# EAGLE design ATmega32u4_Example (EAGLE 9.3.2)
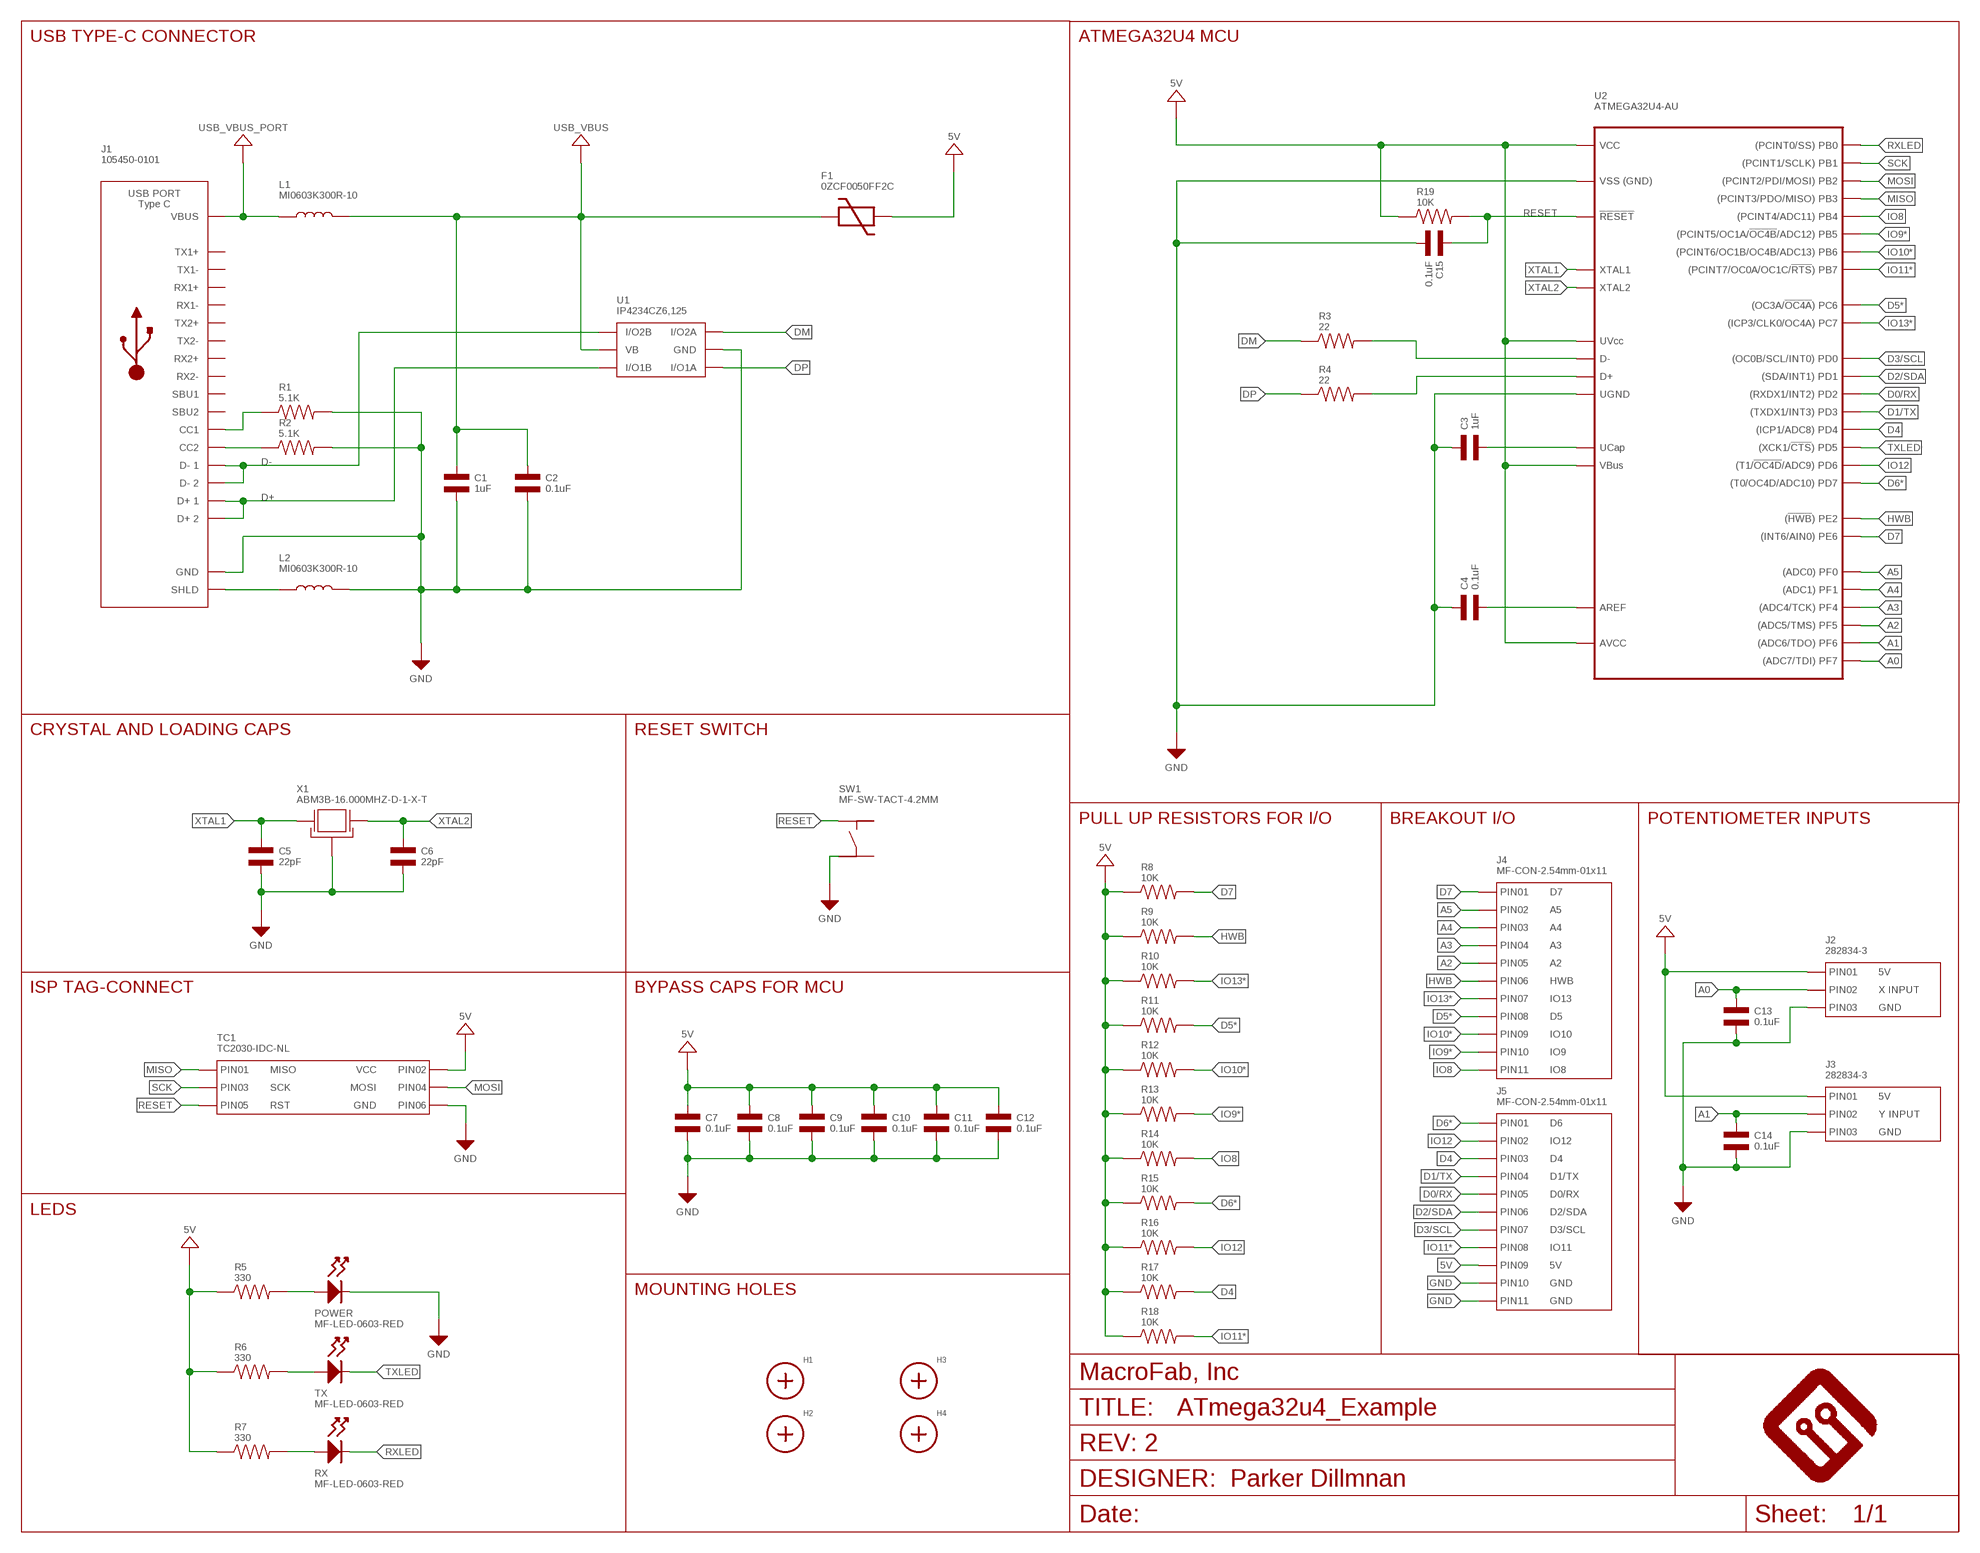
[diagram p0: schematic, sheet 1]

## Parts
C1  1uF  CAPACITOR_NP_0603  [C0603]
C2  0.1uF  CAPACITOR_NP_0603  [C0603]
C3  1uF  CAPACITOR_NP_0603  [C0603]
C4  0.1uF  CAPACITOR_NP_0603  [C0603]
C5  22pF  CAPACITOR_NP_0603  [C0603]
C6  22pF  CAPACITOR_NP_0603  [C0603]
C7  0.1uF  CAPACITOR_NP_0603  [C0603]
C8  0.1uF  CAPACITOR_NP_0603  [C0603]
C9  0.1uF  CAPACITOR_NP_0603  [C0603]
C10  0.1uF  CAPACITOR_NP_0603  [C0603]
C11  0.1uF  CAPACITOR_NP_0603  [C0603]
C12  0.1uF  CAPACITOR_NP_0603  [C0603]
C13  0.1uF  CAPACITOR_NP_0603  [C0603]
C14  0.1uF  CAPACITOR_NP_0603  [C0603]
C15  0.1uF  CAPACITOR_NP_0603  [C0603]
F1  0ZCF0050FF2C  PTC_FUSE_2920  [2920]
FRAME1  MF_FRAMEDEFAULT  [MF_FRAME_DEFAULT]
H1  MOUNT_HOLE150MIL  [MOUNT_HOLE_150MIL]
H2  MOUNT_HOLE150MIL  [MOUNT_HOLE_150MIL]
H3  MOUNT_HOLE150MIL  [MOUNT_HOLE_150MIL]
H4  MOUNT_HOLE150MIL  [MOUNT_HOLE_150MIL]
J1  105450-0101  USB_TYPE-C_105450-0101  [105450-0101]
J2  282834-3  CON_01X03_282834-3  [282834-3]
J3  282834-3  CON_01X03_282834-3  [282834-3]
J4  MF-CON-2.54mm-01x11  CON_01X11_PTH_2.54MM  [PTH_2.54MM_01X11]
J5  MF-CON-2.54mm-01x11  CON_01X11_PTH_2.54MM  [PTH_2.54MM_01X11]
L1  MI0603K300R-10  INDUCTOR_0603  [L0603]
L2  MI0603K300R-10  INDUCTOR_0603  [L0603]
POWER  MF-LED-0603-RED  LED_SINGLE-0603-RED  [LED0603]
R1  5.1K  RESISTOR_0603  [R0603]
R2  5.1K  RESISTOR_0603  [R0603]
R3  22  RESISTOR_0603  [R0603]
R4  22  RESISTOR_0603  [R0603]
R5  330  RESISTOR_0603  [R0603]
R6  330  RESISTOR_0603  [R0603]
R7  330  RESISTOR_0603  [R0603]
R8  10K  RESISTOR_0603  [R0603]
R9  10K  RESISTOR_0603  [R0603]
R10  10K  RESISTOR_0603  [R0603]
R11  10K  RESISTOR_0603  [R0603]
R12  10K  RESISTOR_0603  [R0603]
R13  10K  RESISTOR_0603  [R0603]
R14  10K  RESISTOR_0603  [R0603]
R15  10K  RESISTOR_0603  [R0603]
R16  10K  RESISTOR_0603  [R0603]
R17  10K  RESISTOR_0603  [R0603]
R18  10K  RESISTOR_0603  [R0603]
R19  10K  RESISTOR_0603  [R0603]
RX  MF-LED-0603-RED  LED_SINGLE-0603-RED  [LED0603]
SW1  MF-SW-TACT-4.2MM  TACT_4.2MM  [TACT4.2MM]
TC1  TC2030-IDC-NL  CON_02X03_AVRISP_TC2030-IDC-NL  [TC2030-IDC-NL]
TX  MF-LED-0603-RED  LED_SINGLE-0603-RED  [LED0603]
U1  IP4234CZ6,125  IP4234CZ6  [IP4234CZ6_SOT-457-6]
U2  ATMEGA32U4-AU  [TQFP44]
X1  ABM3B-16.000MHZ-D-1-X-T  CYRSTAL_GND_ABM3B  [5MMX3.2MM]

## Nets
5V: C7.P$1 C8.P$1 C9.P$1 C10.P$1 C11.P$1 C12.P$1 F1.2 J2.P$1(PIN1) J3.P$1(PIN1) J5.P$9(PIN9) R5.P$1 R6.P$1 R7.P$1 R8.P$1 R9.P$1 R10.P$1 R11.P$1 R12.P$1 R13.P$1 R14.P$1 R15.P$1 R16.P$1 R17.P$1 R18.P$1 R19.P$1 TC1.P$2(PIN2) U2.P$2(UVCC) U2.P$7(VBUS) U2.P$14(VCC) U2.P$24(AVCC) U2.P$34(VCC) U2.P$44(AVCC)
A0: C13.P$1 J2.P$2(PIN2) U2.P$36(PF7)
A1: C14.P$1 J3.P$2(PIN2) U2.P$37(PF6)
A2: J4.P$5(PIN5) U2.P$38(PF5)
A3: J4.P$4(PIN4) U2.P$39(PF4)
A4: J4.P$3(PIN3) U2.P$40(PF1)
A5: J4.P$2(PIN2) U2.P$41(PF0)
CC1: J1.A5(CC1) R1.P$1
CC2: J1.B5(CC2) R2.P$1
D0/RX: J5.P$5(PIN5) U2.P$20(PD2)
D1/TX: J5.P$4(PIN4) U2.P$21(PD3)
D2/SDA: J5.P$6(PIN6) U2.P$19(PD1)
D3/SCL: J5.P$7(PIN7) U2.P$18(PD0)
D4: J5.P$3(PIN3) R17.P$2 U2.P$25(PD4)
D5*: J4.P$8(PIN8) R11.P$2 U2.P$31(PC6)
D6*: J5.P$1(PIN1) R15.P$2 U2.P$27(PD7)
D7: J4.P$1(PIN1) R8.P$2 U2.P$1(PE6)
D+: J1.A6(D+1) J1.B6(D+2) U1.3(I/O1B)
D-: J1.A7(D-1) J1.B7(D-2) U1.4(I/O2B)
DM: R3.P$1 U1.6(I/O2A)
DP: R4.P$1 U1.1(I/O1A)
GND: C1.P$2 C2.P$2 C3.P$1 C4.P$1 C5.P$2 C6.P$2 C7.P$2 C8.P$2 C9.P$2 C10.P$2 C11.P$2 C12.P$2 C13.P$2 C14.P$2 C15.P$2 J1.A1(GND) J1.A12(GND) J1.B1(GND) J1.B12(GND) J2.P$3(PIN3) J3.P$3(PIN3) J5.P$10(PIN10) J5.P$11(PIN11) L2.P$2 POWER.CATHODE R1.P$2 R2.P$2 SW1.P$3 TC1.P$6(PIN6) U1.2(GND) U2.P$5(UGND) U2.P$15(GND) U2.P$23(GND) U2.P$35(GND) U2.P$43(GND) X1.P$2(GND) X1.P$4(GND)
HWB: J4.P$6(PIN6) R9.P$2 U2.P$33(PE2)
IO8: J4.P$11(PIN11) R14.P$2 U2.P$28(PB4)
IO9*: J4.P$10(PIN10) R13.P$2 U2.P$29(PB5)
IO10*: J4.P$9(PIN9) R12.P$2 U2.P$30(PB6)
IO11*: J5.P$8(PIN8) R18.P$2 U2.P$12(PB7)
IO12: J5.P$2(PIN2) R16.P$2 U2.P$26(PD6)
IO13*: J4.P$7(PIN7) R10.P$2 U2.P$32(PC7)
MISO: TC1.P$1(PIN1) U2.P$11(PB3)
MOSI: TC1.P$4(PIN4) U2.P$10(PB2)
N$1: R3.P$2 U2.P$3(D-)
N$2: R4.P$2 U2.P$4(D+)
N$3: C3.P$2 U2.P$6(UCAP)
N$4: C4.P$2 U2.P$42(AREF)
N$5: POWER.ANODE R5.P$2
N$6: R6.P$2 TX.ANODE
N$7: R7.P$2 RX.ANODE
RESET: C15.P$1 R19.P$2 SW1.P$1 TC1.P$5(PIN5) U2.P$13(!RESET)
RXLED: RX.CATHODE U2.P$8(PB0)
SCK: TC1.P$3(PIN3) U2.P$9(PB1)
SHEILD1: J1.S_T1(SHLD) J1.S_T2(SHLD) J1.S_T3(SHLD) J1.S_T4(SHLD) L2.P$1
TXLED: TX.CATHODE U2.P$22(PD5)
USB_VBUS: C1.P$1 C2.P$1 F1.1 L1.P$2 U1.5(VB)
USB_VBUS_PORT: J1.A4(VBUS) J1.A9(VBUS) J1.B4(VBUS) J1.B9(VBUS) L1.P$1
XTAL1: C5.P$1 U2.P$17(XTAL1) X1.P$1(X0)
XTAL2: C6.P$1 U2.P$16(XTAL2) X1.P$3(X1)
Unconnected: J1.A2(TX1+) J1.A3(TX1-) J1.A8(SBU1) J1.A10(RX2-) J1.A11(RX2+) J1.B2(TX2+) J1.B3(TX2-) J1.B8(SBU2) J1.B10(RX1-) J1.B11(RX1+) SW1.P$2 SW1.P$4

## Notes on the sheet
- USB TYPE-C CONNECTOR | ATMEGA32U4 MCU
- CRYSTAL AND LOADING CAPS | RESET SWITCH
- PULL UP RESISTORS FOR I/O | BREAKOUT I/O | POTENTIOMETER INPUTS
- ISP TAG-CONNECT | BYPASS CAPS FOR MCU
- LEDS
- MOUNTING HOLES

## Library data of the parts
C1 C3 = MF_Passives:CAPACITOR_NP: Library: MF_Passives Description: Device for Non-Polarized Capacitors. Manufacture part number (MPN) can be added via Attributes. Check https://factory.macrofab.com/parts for the house parts list.; MPN: MF-CAP-0603-1uF; POPULATE: 1
C2 C4 C7-C15 = MF_Passives:CAPACITOR_NP: Library: MF_Passives Description: Device for Non-Polarized Capacitors. Manufacture part number (MPN) can be added via Attributes. Check https://factory.macrofab.com/parts for the house parts list.; MPN: MF-CAP-0603-0.1uF; POPULATE: 1
C5 C6 = MF_Passives:CAPACITOR_NP: Library: MF_Passives Description: Device for Non-Polarized Capacitors. Manufacture part number (MPN) can be added via Attributes. Check https://factory.macrofab.com/parts for the house parts list.; MPN: MF-CAP-0603-22pF; POPULATE: 1
F1 = PP_Passives:PTC_FUSE; MPN: 0ZCF0050FF2C
FRAME1 = MF_Aesthetics:MF_FRAME: Library: MF_Aesthetics Description: Frame for adding Meta Data to the PCB and Schematic.; DNAME: Parker Dillmnan; HOUSEPART: 0; POPULATE: 0; REVNUM: REV: 2
H1-H4 = PP_Connectors:MOUNT_HOLE; POPULATE: 0
J1 = PP_Connectors:USB_TYPE-C; MPN: 105450-0101; POPULATE: 1
J2 = PP_Connectors:CON_01X03: 3 pin connectors; LABEL01: 5V; LABEL02: X INPUT; LABEL03: GND; MPN: 282834-3
J3 = PP_Connectors:CON_01X03: 3 pin connectors; LABEL01: 5V; LABEL02: Y INPUT; LABEL03: GND; MPN: 282834-3
J4 = MF_Connectors:CON_01X11: Library: MF_Connectors Description: Header Connector with 11 Positions and 01 Rows. Use the LABEL Attribute to label the pin on the schematic and PCB. You can remove the attributes on the PCB by using the SMASH function on the part and then deleting the text.; HOUSEPART: YES; LABEL01: D7; LABEL02: A5; LABEL03: A4; LABEL04: A3; LABEL05: A2; LABEL06: HWB; LABEL07: IO13; LABEL08: D5; LABEL09: IO10; LABEL10: IO9; LABEL11: IO8; MPN: MF-CON-2.54mm-01x11; POPULATE: 1; URL: https://factory.macrofab.com/part/MF-CON-2.54mm-01x11
J5 = MF_Connectors:CON_01X11: Library: MF_Connectors Description: Header Connector with 11 Positions and 01 Rows. Use the LABEL Attribute to label the pin on the schematic and PCB. You can remove the attributes on the PCB by using the SMASH function on the part and then deleting the text.; HOUSEPART: YES; LABEL01: D6; LABEL02: IO12; LABEL03: D4; LABEL04: D1/TX; LABEL05: D0/RX; LABEL06: D2/SDA; LABEL07: D3/SCL; LABEL08: IO11; LABEL09: 5V; LABEL10: GND; LABEL11: GND; MPN: MF-CON-2.54mm-01x11; POPULATE: 1; URL: https://factory.macrofab.com/part/MF-CON-2.54mm-01x11
L1 L2 = MF_Passives:INDUCTOR: Library: MF_Passives Description: Device for Inductors. Manufacture part number (MPN) can be added via Attributes. Check https://factory.macrofab.com/parts for the house parts list.; MPN: MI0603K300R-10; POPULATE: 1
POWER RX TX = MF_LEDs:LED_SINGLE: Library: MF_LEDs Description: Device for Single LED Packages. Manufacture part number (MFG#) can be added via Attributes.; HOUSEPART: YES; MPN: MF-LED-0603-RED; POPULATE: 1; URL: https://factory.macrofab.com/part/MF-LED-0603-RED
R1 R2 = MF_Passives:RESISTOR: Library: MF_Passives Description: Device for Resistors. Manufacture part number (MPN), Voltage, Tolerance, and Wattage Rating can be added via Attributes. Check https://factory.macrofab.com/parts for the house parts list.; MPN: ERJ-3EKF5101V; POPULATE: 1
R3 R4 = MF_Passives:RESISTOR: Library: MF_Passives Description: Device for Resistors. Manufacture part number (MPN), Voltage, Tolerance, and Wattage Rating can be added via Attributes. Check https://factory.macrofab.com/parts for the house parts list.; MPN: MF-RES-0603-22; POPULATE: 1
R5-R7 = MF_Passives:RESISTOR: Library: MF_Passives Description: Device for Resistors. Manufacture part number (MPN), Voltage, Tolerance, and Wattage Rating can be added via Attributes. Check https://factory.macrofab.com/parts for the house parts list.; MPN: MF-RES-0603-330; POPULATE: 1
R8-R19 = MF_Passives:RESISTOR: Library: MF_Passives Description: Device for Resistors. Manufacture part number (MPN), Voltage, Tolerance, and Wattage Rating can be added via Attributes. Check https://factory.macrofab.com/parts for the house parts list.; MPN: MF-RES-0603-10K; POPULATE: 1
SW1 = MF_Switches:TACT: Library: MF_Switches Description: Device for Tact Switches. Manufacture part number (MFG#) can be added via Attributes.; HOUSEPART: YES; MPN: MF-SW-TACT-4.2MM; POPULATE: 1; URL: https://factory.macrofab.com/part/MF-SW-TACT-4.2MM
TC1 = MF_Connectors:CON_02X03: Library: MF_Connectors Description: Header Connector with 6 Positions and 02 Rows. Use the LABEL Attribute to label the pin on the schematic and PCB. You can remove the attributes on the PCB by using the SMASH function on the part and then deleting the text.; HOUSEPART: NO; LABEL01: MISO; LABEL02: VCC; LABEL03: SCK; LABEL04: MOSI; LABEL05: RST; LABEL06: GND; MPN: TC2030-IDC-NL; POPULATE: 0; URL: http://www.tag-connect.com/AVRISP
U1 = PP_Passives:IP4234CZ6: Mouser Part #: 771-IP4234CZ6125 Manufacturer Part #: IP4234CZ6,125 Manufacturer: NXP Semiconductors Description: ESD Suppressors Single USB 2.0 ESD Protection 6-Pin http://www.mouser.com/ProductDetail/NXP-Semiconductors/IP4234CZ6125/?qs=sGAEpiMZZMvxHShE6Whpu7QUdHOfUl1T0xbl582qhFk%3d; MPN: IP4234CZ6,125
U2 = MF_IC_Digital:ATMEGA32U4: Manufacturer Part #: ATMEGA32U4 Manufacturer: Atmel Description: 8-bit Microcontrollers - MCU AVR USB 32K FLASH INDUSTRIAL; HOUSEPART: NO; MPN: ATMEGA32U4-AU; POPULATE: 1; URL: http://www.atmel.com/devices/atmega32u4.aspx
X1 = MF_Frequency_Control:CYRSTAL_GND: Library: MF_Frequency_Control Description: Device for two functional pin Cyrstal Oscillators and a ground.; HOUSEPART: NO; MPN: ABM3B-16.000MHZ-D-1-X-T; POPULATE: 1; URL: http://www.abracon.com/Resonators/abm3b.pdf

## Board
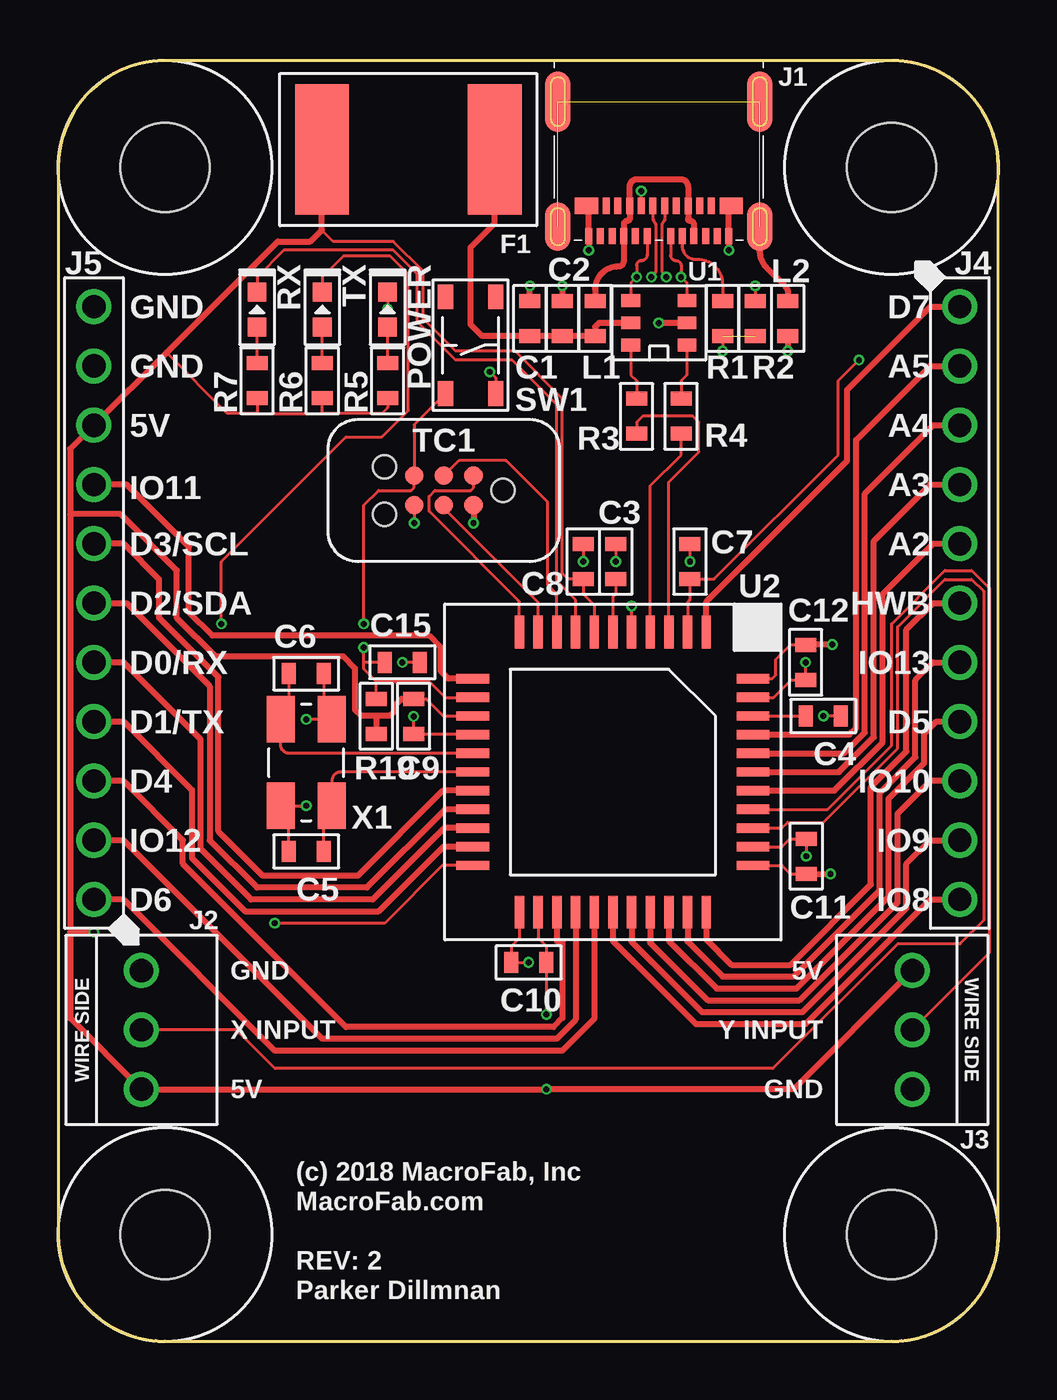
[diagram p1: board, top side]
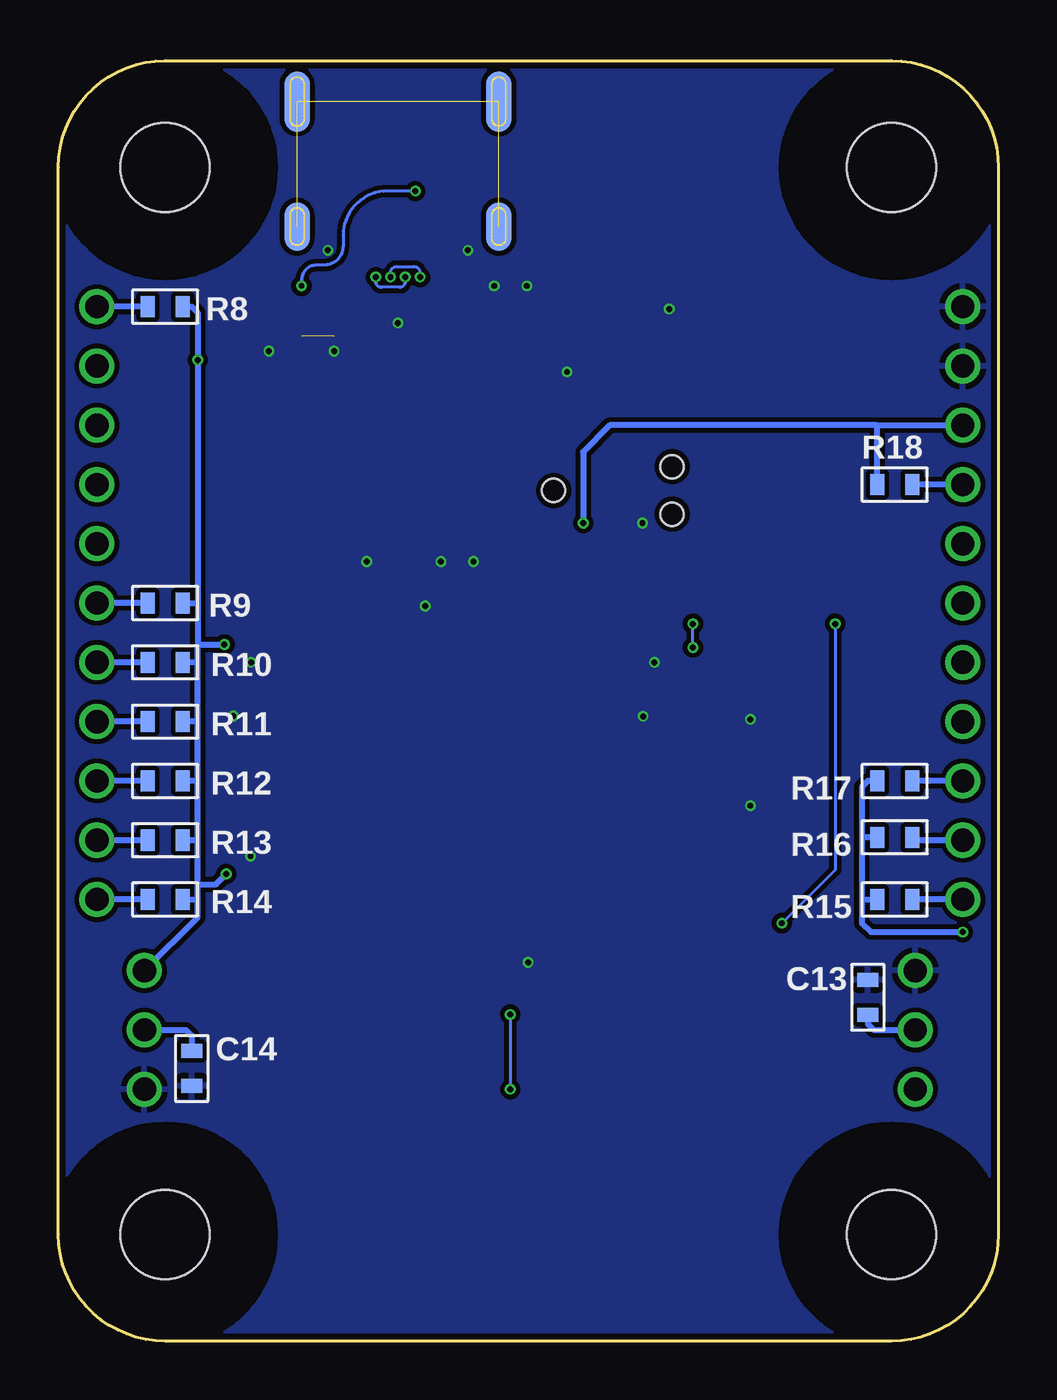
[diagram p2: board, bottom side, seen from below]

Size 40.26 x 54.86 mm. Coordinates in mm from the lower left corner, seen from the top.
Outline: 35.69,54.86 4.57,54.86 arc90 0,50.29 0,4.57 arc90 4.57,0 35.69,0 arc90 40.26,4.57 40.26,50.29 arc90 35.69,54.86
Copper layers (1*16): Top 0.035mm / dielectric 1.5mm / Bottom 0.035mm
Design rules "MF_Standard_2_Layer": minimum track width 5mil, minimum drill 10mil, track to track 5mil, track to pad 5mil, pad to pad 5mil, via to via 5mil, smd to smd 0mil, copper to edge 10mil, drill to drill 10mil, minimum pad ring 4mil, minimum via ring 4mil, stop-mask expansion 2mil, vias tented up to drill 25mil, thermal gap 10mil

### Footprints (pad centres in the part's own frame; a part is rotated, then mirrored left to right if it is on the bottom)
C0603 = smd 0.6 x 0.9: P$1 -0.75,0; P$2 0.75,0
2920 = smd 2.3 x 5.6: 1 -3.7,0; 2 3.7,0
MOUNT_HOLE_150MIL = hole 3.81: 0,0
105450-0101 = smd 0.3 x 0.7: A1 -3,0.41; A2 -2.5,0.41; A3 -2,0.41; A4 -1.5,0.41; A5 -1,0.41; A6 -0.5,0.41; A7 0.5,0.41; A8 1,0.41; A9 1.5,0.41; A10 2,0.41; A11 2.5,0.41; A12 3,0.41; B2 2.25,-0.89; B3 1.75,-0.89; B4 1.25,-0.89; B5 0.75,-0.89; B6 0.25,-0.89; B7 -0.25,-0.89; B8 -0.75,-0.89; B9 -1.25,-0.89; B10 -1.75,-0.89; B11 -2.25,-0.89 | smd 1 x 0.7: B1 3.1,-0.89; B12 -3.1,-0.89 | smd 1.1 x 2.6 bottom: S_B1 -4.32,-5.36; S_B4 4.32,-5.36 | smd 1.1 x 2.1 bottom: S_B2 -4.32,0; S_B3 4.32,0 | smd 1.1 x 2.6: S_T1 -4.32,-5.36; S_T4 4.32,-5.36 | smd 1.1 x 2.1: S_T2 -4.32,0; S_T3 4.32,0
282834-3 = drill 1: P$1 -2.54,0; P$2 0,0; P$3 2.54,0
PTH_2.54MM_01X11 = drill 1: P$1 -12.7,0; P$2 -10.16,0; P$3 -7.62,0; P$4 -5.08,0; P$5 -2.54,0; P$6 0,0; P$7 2.54,0; P$8 5.08,0; P$9 7.62,0; P$10 10.16,0; P$11 12.7,0
L0603 = smd 0.6 x 0.9: P$1 -0.75,0; P$2 0.75,0
LED0603 = smd 0.8 x 0.8: ANODE 0.75,0; CATHODE -0.75,0
R0603 = smd 0.6 x 0.9: P$1 -0.75,0; P$2 0.75,0
TACT4.2MM = smd 1.05 x 0.65: P$1 -2.075,1.075; P$2 2.075,1.075; P$3 -2.075,-1.075; P$4 2.075,-1.075
TC2030-IDC-NL = smd 0.787 x 0.787: P$1 -1.27,-0.635; P$2 -1.27,0.635; P$3 0,-0.635; P$4 0,0.635; P$5 1.27,-0.635; P$6 1.27,0.635 | hole 0.991: 2.54,1.016; 2.54,-1.016; -2.54,0
IP4234CZ6_SOT-457-6 = smd 0.8 x 0.55: 1 -1.2,0.95; 2 -1.2,0; 3 -1.2,-0.95; 4 1.2,-0.95; 5 1.2,0; 6 1.2,0.95
TQFP44 = smd 1.4 x 0.4: P$1 -6,4; P$2 -6,3.2; P$3 -6,2.4; P$4 -6,1.6; P$5 -6,0.8; P$6 -6,0; P$7 -6,-0.8; P$8 -6,-1.6; P$9 -6,-2.4; P$10 -6,-3.2; P$11 -6,-4; P$23 6,-4; P$24 6,-3.2; P$25 6,-2.4; P$26 6,-1.6; P$27 6,-0.8; P$28 6,0; P$29 6,0.8; P$30 6,1.6; P$31 6,2.4; P$32 6,3.2; P$33 6,4 | smd 0.4 x 1.4: P$12 -4,-6; P$13 -3.2,-6; P$14 -2.4,-6; P$15 -1.6,-6; P$16 -0.8,-6; P$17 0,-6; P$18 0.8,-6; P$19 1.6,-6; P$20 2.4,-6; P$21 3.2,-6; P$22 4,-6; P$34 4,6; P$35 3.2,6; P$36 2.4,6; P$37 1.6,6; P$38 0.8,6; P$39 0,6; P$40 -0.8,6; P$41 -1.6,6; P$42 -2.4,6; P$43 -3.2,6; P$44 -4,6
5MMX3.2MM = smd 1.2 x 2: P$1 -1.1,1.85; P$2 -1.1,-1.85; P$3 1.1,-1.85; P$4 1.1,1.85

### Placement (x,y rotation side)
C1  20.19,43.81 90 top
C2  21.59,43.81 90 top
C3  23.88,33.4 270 top
C4  32.77,26.78 180 top
C5  10.62,20.98 180 top
C6  10.62,28.6 0 top
C7  27.05,33.4 90 top
C8  22.48,33.4 90 top
C9  15.21,26.77 270 top
C10  20.14,16.23 180 top
C11  32.03,20.78 90 top
C12  32,29.08 270 top
C13  5.59,14.73 90 bottom
C14  34.54,11.68 270 bottom
C15  14.73,29.08 0 top
F1  14.99,51.05 180 top
FRAME1  10.16,8.13 0 top
H1  4.57,50.29 0 top
H2  35.69,50.29 0 top
H3  4.57,4.57 0 top
H4  35.69,4.57 0 top
J1  25.72,47.75 180 top
J2  3.56,13.34 90 top
J3  36.58,13.34 270 top
J4  38.61,31.62 270 top
J5  1.52,31.62 90 top
L1  22.99,43.81 270 top
L2  31.24,43.81 270 top
POWER  14.1,44.2 270 top
R1  28.45,43.81 270 top
R2  29.84,43.81 270 top
R3  24.77,39.62 270 top
R4  26.67,39.62 270 top
R5  14.1,41.15 90 top
R6  11.3,41.15 90 top
R7  8.51,41.15 90 top
R8  35.69,44.32 180 bottom
R9  35.69,31.62 180 bottom
R10  35.69,29.08 180 bottom
R11  35.69,26.54 180 bottom
R12  35.69,24 180 bottom
R13  35.69,21.46 180 bottom
R14  35.69,18.92 180 bottom
R15  4.45,18.92 0 bottom
R16  4.45,21.59 0 bottom
R17  4.45,24 0 bottom
R18  4.45,36.7 0 bottom
R19  13.61,26.77 90 top
RX  8.51,44.2 270 top
SW1  17.65,42.67 90 top
TC1  16.51,36.45 180 top
TX  11.3,44.2 270 top
U1  25.72,43.62 180 top
U2  23.75,24.38 270 top
X1  10.62,24.79 180 top

### Tracks (layer width: path | path; a pad name or v marks a point on that pad's centre or on a via)
5V  (via drill 0.25)
  Top 0.127: U2.P$2 26.95,31.65 27.05,31.75 C7.P$1 28.08,32.65 33.4,37.97 33.4,41.15 v34.29,42.04 | U2.P$7 22.95,31.53 22.48,32 C8.P$1 21.83,32.65 21.59,32.89 21.59,40.39 19.56,42.42 17.02,42.42 15.62,43.81 15.62,45.85 14.35,47.12 11.78,47.12 11.29,47.61 | C9.P$1 15.75,27.52 16.49,26.78 U2.P$14 | U2.P$24 20.55,17.27 20.89,16.93 C10.P$1 v20.89,13.99 v20.9,13.99 | U2.P$34 30.99,20.38 31.34,20.03 C11.P$1 | U2.P$44 30.57,28.38 30.73,28.55 30.73,29.21 31.37,29.84 32,29.84 C12.P$1 | 33.06,20.03 v33.07,20.02 | R7.P$1 8.51,39.75 | 8.51,39.75 11.3,39.75 | 11.3,39.75 R6.P$1 | R5.P$1 14.1,40.01 13.84,39.75 11.3,39.75 | 8.51,39.75 7.24,39.75 4.64,42.35
  Top 0.254: C11.P$1 33.06,20.03 | 0.51,35.43 0.51,38.23 J5.P$9 4.64,42.35 9.4,47.12 10.79,47.12 11.29,47.61 F1.2 | 13.62,26.8 12.95,26.8 12.7,27.05 12.7,28.83 12.19,29.34 6.73,29.34 5.08,30.99 5.08,33.02 2.67,35.43 0.51,35.43 | 13.62,26.8 R19.P$1 | C9.P$1 14.7,27.52 14.4,27.23 14.4,26.98 14.22,26.8 13.62,26.8 | 0.51,35.43 0.51,17.53 | v33.15,29.84 32,29.84 | TC1.P$2 v17.78,35.05 | v1.52,17.53 0.51,17.53 | 0.51,17.53 0.51,13.84 J2.P$1 v20.9,10.79 31.5,10.79 J3.P$1
  Bottom 0.127: v20.9,13.99 v20.9,10.79
  Bottom 0.254: v33.07,20.02 33.53,19.56 34.29,19.56 | R9.P$1 34.29,31.62 | 34.29,31.62 34.29,29.84 | 34.29,29.08 R10.P$1 | 34.29,26.54 R11.P$1 | 34.29,24 R12.P$1 | 5.84,18.92 R15.P$1 | R14.P$1 34.29,18.92 | 34.29,29.84 v33.15,29.84 | 5.21,39.24 J5.P$9 | R17.P$1 5.59,24 5.84,23.75 5.84,21.59 | 5.84,21.59 5.84,18.92 | R16.P$1 5.84,21.59 | 5.84,18.92 5.84,17.91 5.46,17.53 v1.52,17.53 | R18.P$1 5.2,39.23 5.21,39.24 | 34.29,18.92 34.29,19.56 | 34.29,19.56 34.29,21.46 | 34.29,21.46 R13.P$1 | 34.29,21.46 34.29,24 | 34.29,24 34.29,26.54 | 34.29,26.54 34.29,29.08 | 34.29,29.08 34.29,29.84 | R8.P$1 34.54,44.32 34.29,44.07 v34.29,42.04 34.29,31.62 | J3.P$1 34.29,18.16 34.29,18.92 | v17.78,35.05 17.78,38.1 16.64,39.24 5.21,39.24
A0
  Top 0.127: U2.P$36 30.99,21.98 31.23,22.23 32.77,22.23 35.94,25.4 35.94,30.61 37.97,32.64 39.12,32.64 39.62,32.13 39.62,18.03 38.61,17.02 35.94,17.02 30.61,11.68 9.27,11.68 7.62,13.34 J2.P$2
  Bottom 0.254: C13.P$1 5.59,13.59 5.33,13.34 J2.P$2
A1
  Top 0.127: U2.P$37 32.94,22.78 35.69,25.53 35.69,30.73 37.97,33.02 39.12,33.02 39.88,32.26 39.88,16.64 J3.P$2
  Bottom 0.254: J3.P$2 34.8,13.34 34.54,13.08 C14.P$1
A2
  Top 0.254: U2.P$38 33.24,23.58 35.31,25.65 35.31,32 37.47,34.16 J4.P$5
A3
  Top 0.254: U2.P$39 33.43,24.38 34.92,25.88 34.92,34.29 37.34,36.7 J4.P$4
A4
  Top 0.254: U2.P$40 33.64,25.18 34.54,26.09 34.54,36.32 37.47,39.24 J4.P$3
A5
  Top 0.254: U2.P$41 33.88,25.98 34.16,26.26 34.16,38.61 37.34,41.78 J4.P$2
CC1
  Top 0.127: R1.P$1 28.45,44.96 28.45,45.09 28.45,45.28 arc90 27.37,46.35 27.28,46.35 arc-90 26.72,46.92 J1.A5
CC2  (via drill 0.25)
  Top 0.127: J1.B5 v24.97,49.27 v24.97,49.28 | v29.84,45.21 R2.P$1
  Bottom 0.127: v24.97,49.28 26.16,49.28 arc-90 28.07,47.37 28.07,46.92 arc90 28.89,46.1 29.21,46.1 arc-90 29.84,45.47 v29.84,45.21
D0/RX
  Top 0.254: U2.P$20 16.52,21.98 13.46,18.92 8.26,18.92 6.1,21.08 6.1,25.78 2.79,29.08 J5.P$5
D1/TX
  Top 0.254: U2.P$21 16.48,21.18 13.72,18.41 8,18.41 5.71,20.7 5.71,23.62 2.79,26.54 J5.P$4
D2/SDA
  Top 0.254: U2.P$19 16.56,22.78 13.21,19.43 8.51,19.43 6.48,21.46 6.48,28.07 2.92,31.62 J5.P$6
D3/SCL
  Top 0.254: U2.P$18 16.47,23.58 12.83,19.94 8.76,19.94 6.86,21.84 6.86,28.45 4.32,30.99 4.32,32.64 2.79,34.16 J5.P$7
D4
  Top 0.254: U2.P$25 21.35,17.14 21.59,17.14 21.59,13.84 21.21,13.46 12.32,13.46 5.33,20.45 5.33,21.46 2.79,24 J5.P$3
  Bottom 0.254: J5.P$3 R17.P$2
D5*
  Top 0.254: U2.P$31 26.15,17.16 28.19,15.11 31.62,15.11 35.56,19.05 35.56,23.24 37.08,24.77 37.08,26.04 37.59,26.54 J4.P$8
  Bottom 0.254: R11.P$2 J4.P$8
D6*
  Top 0.254: U2.P$27 22.95,13.8 21.59,12.45 9.27,12.45 2.79,18.92 J5.P$1
  Bottom 0.254: J5.P$1 R15.P$2
D7
  Top 0.254: U2.P$1 27.75,31.69 33.78,37.72 33.78,40.77 37.34,44.32 J4.P$1
  Bottom 0.254: R8.P$2 J4.P$1
D+  (via drill 0.25)
  Top 0.127: J1.B6 25.47,48.11 arc44 25.54,47.93 arc-44 25.59,47.8 25.59,45.89 arc-45 25.52,45.71 v25.4,45.59 | J1.A6 26.22,46.55 arc90 26.47,46.29 arc-90 26.67,46.1 v26.67,45.59 26.92,45.34 U1.3
  Bottom 0.127: v25.4,45.59 25.4,45.4 arc90 25.65,45.15 26.41,45.15 arc90 26.67,45.4 v26.67,45.59
D-  (via drill 0.25)
  Top 0.127: J1.B7 25.97,48.08 arc-44 25.92,47.95 arc44 25.84,47.78 25.84,45.89 arc45 25.92,45.71 v26.04,45.59 | J1.A7 25.22,46.55 arc-90 24.96,46.29 arc90 24.77,46.1 v24.77,45.59 24.52,45.34 U1.4
  Bottom 0.127: v26.04,45.59 26.04,45.78 arc90 25.78,46.04 25.02,46.04 arc90 24.77,45.78 v24.77,45.59
DM
  Top 0.127: R3.P$1 24.77,41.15 24.52,41.4 U1.6
DP
  Top 0.127: R4.P$1 26.67,41.15 26.92,41.4 U1.1
GND  (via drill 0.25)  (1 unrouted)
  Top 0.127: R1.P$2 v28.45,42.42 | C3.P$1 v23.88,33.4 | U2.P$5 v24.55,31.5 | C4.P$1 v32.77,26.78 | C7.P$2 v27.05,33.4 | C8.P$2 v22.48,33.4 | U2.P$15 15.25,25.98 C9.P$2 v15.21,26.77 | v10.62,26.64 X1.P$2 11.37,26.64 C6.P$2 | v10.62,22.94 X1.P$4 9.87,22.94 C5.P$2 | U2.P$23 19.75,17.27 19.39,16.91 C10.P$2 v20.14,16.23 | U2.P$35 30.99,21.18 31.33,21.53 C11.P$2 v32.03,20.78 | U2.P$43 30.63,27.58 31.38,28.33 C12.P$2 v32,29.08 | TC1.P$6 v15.24,35.05 | v18.47,41.53 18.73,41.27 SW1.P$3 | POWER.CATHODE v14.1,44.22 | C15.P$2 v14.73,29.08
  Top 0.254: J1.B1 22.72,48.64 J1.A12 v22.72,46.74 | J1.B12 28.72,48.64 J1.A1 v28.72,46.74 | L2.P$2 v31.24,42.42 | v21.59,45.21 C2.P$2 | C1.P$2 v20.19,45.21 | U1.2 v25.72,43.62
  pour Bottom (isolate 0.203, rank 6): 0,54.86 40.26,54.86 40.26,0 0,0
HWB
  Top 0.254: U2.P$33 27.75,17.21 28.83,16.13 31.37,16.13 34.8,19.56 34.8,23.75 36.32,25.27 36.32,30.48 37.47,31.62 J4.P$6
  Bottom 0.254: R9.P$2 J4.P$6
IO8
  Top 0.254: U2.P$28 23.75,17.14 27.3,13.59 32,13.59 37.34,18.92 J4.P$11
  Bottom 0.254: R14.P$2 J4.P$11
IO9*
  Top 0.254: U2.P$29 24.55,17.11 27.56,14.1 31.88,14.1 36.32,18.54 36.32,20.45 37.34,21.46 J4.P$10
  Bottom 0.254: R13.P$2 J4.P$10
IO10*
  Top 0.254: U2.P$30 25.35,17.07 27.81,14.61 31.75,14.61 35.94,18.8 35.94,22.61 37.34,24 J4.P$9
  Bottom 0.254: R12.P$2 J4.P$9
IO11*
  Top 0.254: U2.P$12 16.7,28.38 16.38,28.7 16.38,29.72 15.88,30.23 6.6,30.23 5.59,31.24 5.59,34.04 2.92,36.7 J5.P$8
  Bottom 0.254: J5.P$8 R18.P$2
IO12
  Top 0.254: U2.P$26 22.15,13.77 21.34,12.95 11.3,12.95 2.79,21.46 J5.P$2
  Bottom 0.254: R16.P$2 3.57,21.46 J5.P$2
IO13*
  Top 0.254: U2.P$32 26.95,17.12 28.45,15.62 31.5,15.62 35.18,19.3 35.18,23.5 36.7,25.02 36.7,28.32 37.47,29.08 J4.P$7
  Bottom 0.254: R10.P$2 J4.P$7
MISO
  Top 0.127: U2.P$11 19.75,31.69 15.88,35.56 15.88,36.2 16.13,36.45 17.65,36.45 17.78,36.58 TC1.P$1
MOSI
  Top 0.127: U2.P$10 20.55,31.65 16.51,35.69 TC1.P$4
N$1
  Top 0.127: R3.P$2 24.77,39.37 25.02,39.62 27.18,39.62 27.43,39.37 27.43,38.1 26.15,36.82 U2.P$3
N$2
  Top 0.127: U2.P$4 25.35,36.65 26.67,37.97 R4.P$2
N$3
  Top 0.127: C3.P$2 23.88,32.02 23.75,31.89 U2.P$6
N$4
  Top 0.127: U2.P$42 C4.P$2
N$5
  Top 0.127: R5.P$2 POWER.ANODE
N$6
  Top 0.127: R6.P$2 TX.ANODE
N$7
  Top 0.127: R7.P$2 RX.ANODE
RESET  (via drill 0.25)
  Top 0.127: R19.P$2 13.62,28.27 | U2.P$13 16.56,27.58 15.88,28.27 13.62,28.27 | 13.62,28.27 13.08,28.8 13.08,29.08 | v13.08,30.73 13.08,35.81 13.72,36.45 15.11,36.45 15.24,36.58 TC1.P$5 15.24,39.26 SW1.P$1 | C15.P$1 13.08,29.08 | 13.08,29.08 v13.08,29.72
  Bottom 0.127: v13.08,29.72 v13.08,30.73
RXLED
  Top 0.127: U2.P$8 22.15,31.75 21.34,32.56 21.34,40.13 19.43,42.04 17.02,42.04 15.37,43.69 15.37,45.72 14.35,46.74 9.65,46.74 8.51,45.59 RX.CATHODE
SCK
  Top 0.127: U2.P$9 21.35,32 20.95,32.4 20.95,35.94 19.18,37.72 17.14,37.72 TC1.P$3
SHEILD1  (3 unrouted)
  Top 0.254: J1.S_T2 30.04,46.7 arc45 30.33,46 31.15,45.17 arc-45 31.24,44.96 L2.P$1
TXLED  (via drill 0.25)
  Top 0.127: U2.P$22 16.45,20.38 13.97,17.91 v9.27,17.91 | TX.CATHODE 11.3,45.59 12.19,46.48 14.22,46.48 14.99,45.72 14.99,39.88 13.84,38.73 12.32,38.73 6.99,33.4 v6.99,30.73
  Bottom 0.127: v6.99,30.73 6.99,20.19 v9.27,17.91
USB_VBUS
  Top 0.254: F1.1 18.69,47.9 17.65,46.86 17.65,43.56 18.15,43.06 C1.P$1 C2.P$1 L1.P$2 22.99,43.46 23.15,43.62 U1.5
USB_VBUS_PORT
  Top 0.254: J1.A4 27.22,47.83 arc90 27.04,48.01 arc-90 26.97,48.08 J1.B9 26.97,49.47 arc90 26.65,49.78 24.79,49.78 arc90 24.47,49.47 J1.B4 24.47,48.08 arc-90 24.39,48.01 arc90 24.22,47.83 J1.A9 24.22,46.29 arc-90 23.96,46.04 arc90 22.99,45.06 L1.P$1
XTAL1
  Top 0.127: U2.P$17 12.09,24.38 arc90 11.72,24.01 X1.P$1 11.37,22.94 C5.P$1
XTAL2
  Top 0.127: U2.P$16 9.9,25.18 arc-90 9.52,25.56 X1.P$3 9.87,26.64 C6.P$1